# Altium schematic sheet FIT_FPGA_B-F.SchDoc: FIT_PM12 board
size 420 x 297 mm; CheckedBy: G.Kasprowicz; Author: INR Moscow; CompanyName: WUT ISE; DrawnBy: M.Podgórski; Organization: WUT ISE; Address1: PW ISE; Address2: Nowowiejska 15/19 00-665 Warsaw; Address3: gkasprow@gmail.com; Revision: 2; SheetNumber: -; SheetTotal: -; ModifiedBy: -; CheckedDate: -; Title2: Title 2; DivGrp: WUT ISE; Designer: INR RAS; ModifiedDate: -; ProjectName: Sensor Box
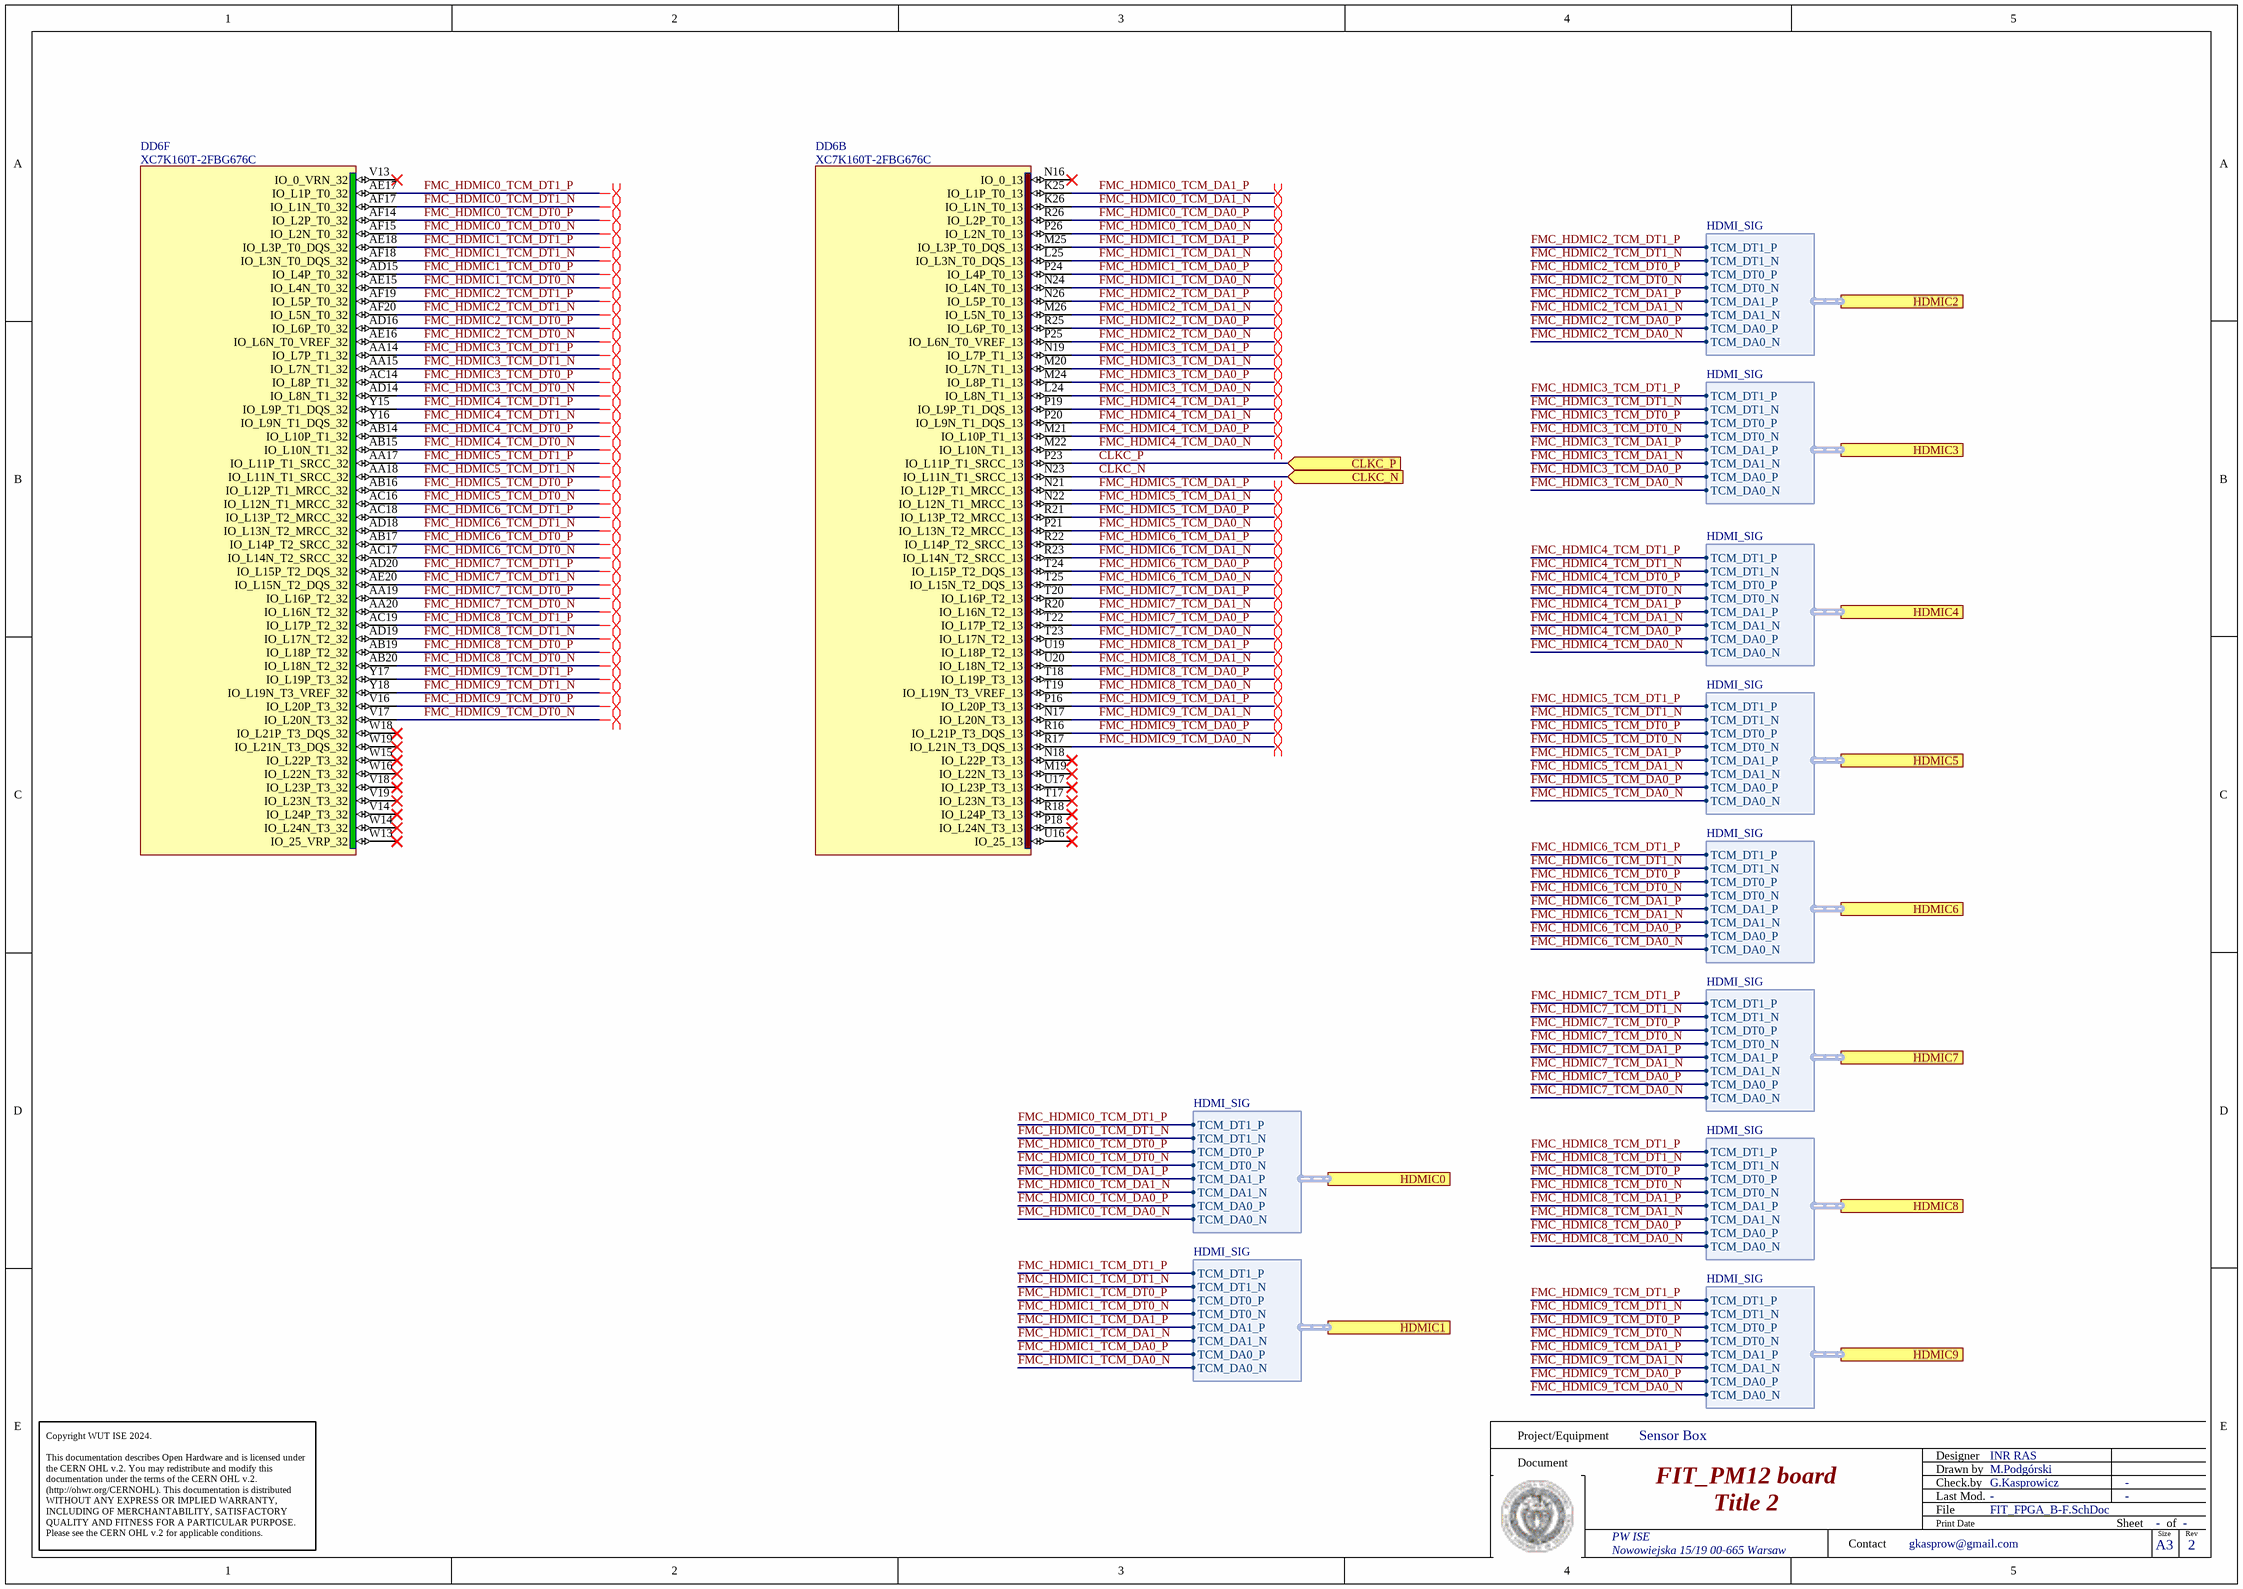
[diagram p0: FIT_FPGA_B-F.SchDoc]

## Parts
DD6  XC7K160T-2FBG676C  [BGA676C100P26X26_2700X2700X254]  (parts B,F of 15)

## Ports
CLKC_N (in), CLKC_P (in), HDMIC0 (harness HDMI_SIG), HDMIC1 (harness HDMI_SIG), HDMIC2 (harness HDMI_SIG), HDMIC3 (harness HDMI_SIG), HDMIC4 (harness HDMI_SIG), HDMIC5 (harness HDMI_SIG), HDMIC6 (harness HDMI_SIG), HDMIC7 (harness HDMI_SIG), HDMIC8 (harness HDMI_SIG), HDMIC9 (harness HDMI_SIG)

## Harnesses
HDMI_SIG: TCM_DT1_P, TCM_DT1_N, TCM_DT0_P, TCM_DT0_N, TCM_DA1_P, TCM_DA1_N, TCM_DA0_P, TCM_DA0_N

## Nets
CLKC_N: DD6.N23(IO_L11N_T1_SRCC_13) ; port CLKC_N
CLKC_P: DD6.P23(IO_L11P_T1_SRCC_13) ; port CLKC_P
FMC_HDMIC0_TCM_DA0_N: DD6.P26(IO_L2N_T0_13) ; port HDMIC0.TCM_DA0_N
FMC_HDMIC0_TCM_DA0_P: DD6.R26(IO_L2P_T0_13) ; port HDMIC0.TCM_DA0_P
FMC_HDMIC0_TCM_DA1_N: DD6.K26(IO_L1N_T0_13) ; port HDMIC0.TCM_DA1_N
FMC_HDMIC0_TCM_DA1_P: DD6.K25(IO_L1P_T0_13) ; port HDMIC0.TCM_DA1_P
FMC_HDMIC0_TCM_DT0_N: DD6.AF15(IO_L2N_T0_32) ; port HDMIC0.TCM_DT0_N
FMC_HDMIC0_TCM_DT0_P: DD6.AF14(IO_L2P_T0_32) ; port HDMIC0.TCM_DT0_P
FMC_HDMIC0_TCM_DT1_N: DD6.AF17(IO_L1N_T0_32) ; port HDMIC0.TCM_DT1_N
FMC_HDMIC0_TCM_DT1_P: DD6.AE17(IO_L1P_T0_32) ; port HDMIC0.TCM_DT1_P
FMC_HDMIC1_TCM_DA0_N: DD6.N24(IO_L4N_T0_13) ; port HDMIC1.TCM_DA0_N
FMC_HDMIC1_TCM_DA0_P: DD6.P24(IO_L4P_T0_13) ; port HDMIC1.TCM_DA0_P
FMC_HDMIC1_TCM_DA1_N: DD6.L25(IO_L3N_T0_DQS_13) ; port HDMIC1.TCM_DA1_N
FMC_HDMIC1_TCM_DA1_P: DD6.M25(IO_L3P_T0_DQS_13) ; port HDMIC1.TCM_DA1_P
FMC_HDMIC1_TCM_DT0_N: DD6.AE15(IO_L4N_T0_32) ; port HDMIC1.TCM_DT0_N
FMC_HDMIC1_TCM_DT0_P: DD6.AD15(IO_L4P_T0_32) ; port HDMIC1.TCM_DT0_P
FMC_HDMIC1_TCM_DT1_N: DD6.AF18(IO_L3N_T0_DQS_32) ; port HDMIC1.TCM_DT1_N
FMC_HDMIC1_TCM_DT1_P: DD6.AE18(IO_L3P_T0_DQS_32) ; port HDMIC1.TCM_DT1_P
FMC_HDMIC2_TCM_DA0_N: DD6.P25(IO_L6N_T0_VREF_13) ; port HDMIC2.TCM_DA0_N
FMC_HDMIC2_TCM_DA0_P: DD6.R25(IO_L6P_T0_13) ; port HDMIC2.TCM_DA0_P
FMC_HDMIC2_TCM_DA1_N: DD6.M26(IO_L5N_T0_13) ; port HDMIC2.TCM_DA1_N
FMC_HDMIC2_TCM_DA1_P: DD6.N26(IO_L5P_T0_13) ; port HDMIC2.TCM_DA1_P
FMC_HDMIC2_TCM_DT0_N: DD6.AE16(IO_L6N_T0_VREF_32) ; port HDMIC2.TCM_DT0_N
FMC_HDMIC2_TCM_DT0_P: DD6.AD16(IO_L6P_T0_32) ; port HDMIC2.TCM_DT0_P
FMC_HDMIC2_TCM_DT1_N: DD6.AF20(IO_L5N_T0_32) ; port HDMIC2.TCM_DT1_N
FMC_HDMIC2_TCM_DT1_P: DD6.AF19(IO_L5P_T0_32) ; port HDMIC2.TCM_DT1_P
FMC_HDMIC3_TCM_DA0_N: DD6.L24(IO_L8N_T1_13) ; port HDMIC3.TCM_DA0_N
FMC_HDMIC3_TCM_DA0_P: DD6.M24(IO_L8P_T1_13) ; port HDMIC3.TCM_DA0_P
FMC_HDMIC3_TCM_DA1_N: DD6.M20(IO_L7N_T1_13) ; port HDMIC3.TCM_DA1_N
FMC_HDMIC3_TCM_DA1_P: DD6.N19(IO_L7P_T1_13) ; port HDMIC3.TCM_DA1_P
FMC_HDMIC3_TCM_DT0_N: DD6.AD14(IO_L8N_T1_32) ; port HDMIC3.TCM_DT0_N
FMC_HDMIC3_TCM_DT0_P: DD6.AC14(IO_L8P_T1_32) ; port HDMIC3.TCM_DT0_P
FMC_HDMIC3_TCM_DT1_N: DD6.AA15(IO_L7N_T1_32) ; port HDMIC3.TCM_DT1_N
FMC_HDMIC3_TCM_DT1_P: DD6.AA14(IO_L7P_T1_32) ; port HDMIC3.TCM_DT1_P
FMC_HDMIC4_TCM_DA0_N: DD6.M22(IO_L10N_T1_13) ; port HDMIC4.TCM_DA0_N
FMC_HDMIC4_TCM_DA0_P: DD6.M21(IO_L10P_T1_13) ; port HDMIC4.TCM_DA0_P
FMC_HDMIC4_TCM_DA1_N: DD6.P20(IO_L9N_T1_DQS_13) ; port HDMIC4.TCM_DA1_N
FMC_HDMIC4_TCM_DA1_P: DD6.P19(IO_L9P_T1_DQS_13) ; port HDMIC4.TCM_DA1_P
FMC_HDMIC4_TCM_DT0_N: DD6.AB15(IO_L10N_T1_32) ; port HDMIC4.TCM_DT0_N
FMC_HDMIC4_TCM_DT0_P: DD6.AB14(IO_L10P_T1_32) ; port HDMIC4.TCM_DT0_P
FMC_HDMIC4_TCM_DT1_N: DD6.Y16(IO_L9N_T1_DQS_32) ; port HDMIC4.TCM_DT1_N
FMC_HDMIC4_TCM_DT1_P: DD6.Y15(IO_L9P_T1_DQS_32) ; port HDMIC4.TCM_DT1_P
FMC_HDMIC5_TCM_DA0_N: DD6.P21(IO_L13N_T2_MRCC_13) ; port HDMIC5.TCM_DA0_N
FMC_HDMIC5_TCM_DA0_P: DD6.R21(IO_L13P_T2_MRCC_13) ; port HDMIC5.TCM_DA0_P
FMC_HDMIC5_TCM_DA1_N: DD6.N22(IO_L12N_T1_MRCC_13) ; port HDMIC5.TCM_DA1_N
FMC_HDMIC5_TCM_DA1_P: DD6.N21(IO_L12P_T1_MRCC_13) ; port HDMIC5.TCM_DA1_P
FMC_HDMIC5_TCM_DT0_N: DD6.AC16(IO_L12N_T1_MRCC_32) ; port HDMIC5.TCM_DT0_N
FMC_HDMIC5_TCM_DT0_P: DD6.AB16(IO_L12P_T1_MRCC_32) ; port HDMIC5.TCM_DT0_P
FMC_HDMIC5_TCM_DT1_N: DD6.AA18(IO_L11N_T1_SRCC_32) ; port HDMIC5.TCM_DT1_N
FMC_HDMIC5_TCM_DT1_P: DD6.AA17(IO_L11P_T1_SRCC_32) ; port HDMIC5.TCM_DT1_P
FMC_HDMIC6_TCM_DA0_N: DD6.T25(IO_L15N_T2_DQS_13) ; port HDMIC6.TCM_DA0_N
FMC_HDMIC6_TCM_DA0_P: DD6.T24(IO_L15P_T2_DQS_13) ; port HDMIC6.TCM_DA0_P
FMC_HDMIC6_TCM_DA1_N: DD6.R23(IO_L14N_T2_SRCC_13) ; port HDMIC6.TCM_DA1_N
FMC_HDMIC6_TCM_DA1_P: DD6.R22(IO_L14P_T2_SRCC_13) ; port HDMIC6.TCM_DA1_P
FMC_HDMIC6_TCM_DT0_N: DD6.AC17(IO_L14N_T2_SRCC_32) ; port HDMIC6.TCM_DT0_N
FMC_HDMIC6_TCM_DT0_P: DD6.AB17(IO_L14P_T2_SRCC_32) ; port HDMIC6.TCM_DT0_P
FMC_HDMIC6_TCM_DT1_N: DD6.AD18(IO_L13N_T2_MRCC_32) ; port HDMIC6.TCM_DT1_N
FMC_HDMIC6_TCM_DT1_P: DD6.AC18(IO_L13P_T2_MRCC_32) ; port HDMIC6.TCM_DT1_P
FMC_HDMIC7_TCM_DA0_N: DD6.T23(IO_L17N_T2_13) ; port HDMIC7.TCM_DA0_N
FMC_HDMIC7_TCM_DA0_P: DD6.T22(IO_L17P_T2_13) ; port HDMIC7.TCM_DA0_P
FMC_HDMIC7_TCM_DA1_N: DD6.R20(IO_L16N_T2_13) ; port HDMIC7.TCM_DA1_N
FMC_HDMIC7_TCM_DA1_P: DD6.T20(IO_L16P_T2_13) ; port HDMIC7.TCM_DA1_P
FMC_HDMIC7_TCM_DT0_N: DD6.AA20(IO_L16N_T2_32) ; port HDMIC7.TCM_DT0_N
FMC_HDMIC7_TCM_DT0_P: DD6.AA19(IO_L16P_T2_32) ; port HDMIC7.TCM_DT0_P
FMC_HDMIC7_TCM_DT1_N: DD6.AE20(IO_L15N_T2_DQS_32) ; port HDMIC7.TCM_DT1_N
FMC_HDMIC7_TCM_DT1_P: DD6.AD20(IO_L15P_T2_DQS_32) ; port HDMIC7.TCM_DT1_P
FMC_HDMIC8_TCM_DA0_N: DD6.T19(IO_L19N_T3_VREF_13) ; port HDMIC8.TCM_DA0_N
FMC_HDMIC8_TCM_DA0_P: DD6.T18(IO_L19P_T3_13) ; port HDMIC8.TCM_DA0_P
FMC_HDMIC8_TCM_DA1_N: DD6.U20(IO_L18N_T2_13) ; port HDMIC8.TCM_DA1_N
FMC_HDMIC8_TCM_DA1_P: DD6.U19(IO_L18P_T2_13) ; port HDMIC8.TCM_DA1_P
FMC_HDMIC8_TCM_DT0_N: DD6.AB20(IO_L18N_T2_32) ; port HDMIC8.TCM_DT0_N
FMC_HDMIC8_TCM_DT0_P: DD6.AB19(IO_L18P_T2_32) ; port HDMIC8.TCM_DT0_P
FMC_HDMIC8_TCM_DT1_N: DD6.AD19(IO_L17N_T2_32) ; port HDMIC8.TCM_DT1_N
FMC_HDMIC8_TCM_DT1_P: DD6.AC19(IO_L17P_T2_32) ; port HDMIC8.TCM_DT1_P
FMC_HDMIC9_TCM_DA0_N: DD6.R17(IO_L21N_T3_DQS_13) ; port HDMIC9.TCM_DA0_N
FMC_HDMIC9_TCM_DA0_P: DD6.R16(IO_L21P_T3_DQS_13) ; port HDMIC9.TCM_DA0_P
FMC_HDMIC9_TCM_DA1_N: DD6.N17(IO_L20N_T3_13) ; port HDMIC9.TCM_DA1_N
FMC_HDMIC9_TCM_DA1_P: DD6.P16(IO_L20P_T3_13) ; port HDMIC9.TCM_DA1_P
FMC_HDMIC9_TCM_DT0_N: DD6.V17(IO_L20N_T3_32) ; port HDMIC9.TCM_DT0_N
FMC_HDMIC9_TCM_DT0_P: DD6.V16(IO_L20P_T3_32) ; port HDMIC9.TCM_DT0_P
FMC_HDMIC9_TCM_DT1_N: DD6.Y18(IO_L19N_T3_VREF_32) ; port HDMIC9.TCM_DT1_N
FMC_HDMIC9_TCM_DT1_P: DD6.Y17(IO_L19P_T3_32) ; port HDMIC9.TCM_DT1_P

Not connected (* = marked no-connect by the designer): DD6 M19(IO_L22N_T3_13)* N16(IO_0_13)* N18(IO_L22P_T3_13)* P18(IO_L24N_T3_13)* R18(IO_L24P_T3_13)* T17(IO_L23N_T3_13)* U16(IO_25_13)* U17(IO_L23P_T3_13)* V13(IO_0_VRN_32)* V14(IO_L24P_T3_32)* V18(IO_L23P_T3_32)* V19(IO_L23N_T3_32)* W13(IO_25_VRP_32)* W14(IO_L24N_T3_32)* W15(IO_L22P_T3_32)* W16(IO_L22N_T3_32)* W18(IO_L21P_T3_DQS_32)* W19(IO_L21N_T3_DQS_32)*

## Layout directives
differential pair: FMC_HDMIC0_TCM_DA0_N, FMC_HDMIC0_TCM_DA0_P, FMC_HDMIC0_TCM_DA1_N, FMC_HDMIC0_TCM_DA1_P, FMC_HDMIC0_TCM_DT0_N, FMC_HDMIC0_TCM_DT0_P, FMC_HDMIC0_TCM_DT1_N, FMC_HDMIC0_TCM_DT1_P, FMC_HDMIC1_TCM_DA0_N, FMC_HDMIC1_TCM_DA0_P, FMC_HDMIC1_TCM_DA1_N, FMC_HDMIC1_TCM_DA1_P, FMC_HDMIC1_TCM_DT0_N, FMC_HDMIC1_TCM_DT0_P, FMC_HDMIC1_TCM_DT1_N, FMC_HDMIC1_TCM_DT1_P, FMC_HDMIC2_TCM_DA0_N, FMC_HDMIC2_TCM_DA0_P, FMC_HDMIC2_TCM_DA1_N, FMC_HDMIC2_TCM_DA1_P, FMC_HDMIC2_TCM_DT0_N, FMC_HDMIC2_TCM_DT0_P, FMC_HDMIC2_TCM_DT1_N, FMC_HDMIC2_TCM_DT1_P, FMC_HDMIC3_TCM_DA0_N, FMC_HDMIC3_TCM_DA0_P, FMC_HDMIC3_TCM_DA1_N, FMC_HDMIC3_TCM_DA1_P, FMC_HDMIC3_TCM_DT0_N, FMC_HDMIC3_TCM_DT0_P, FMC_HDMIC3_TCM_DT1_N, FMC_HDMIC3_TCM_DT1_P, FMC_HDMIC4_TCM_DA0_N, FMC_HDMIC4_TCM_DA0_P, FMC_HDMIC4_TCM_DA1_N, FMC_HDMIC4_TCM_DA1_P, FMC_HDMIC4_TCM_DT0_N, FMC_HDMIC4_TCM_DT0_P, FMC_HDMIC4_TCM_DT1_N, FMC_HDMIC4_TCM_DT1_P, FMC_HDMIC5_TCM_DA0_N, FMC_HDMIC5_TCM_DA0_P, FMC_HDMIC5_TCM_DA1_N, FMC_HDMIC5_TCM_DA1_P, FMC_HDMIC5_TCM_DT0_N, FMC_HDMIC5_TCM_DT0_P, FMC_HDMIC5_TCM_DT1_N, FMC_HDMIC5_TCM_DT1_P, FMC_HDMIC6_TCM_DA0_N, FMC_HDMIC6_TCM_DA0_P, FMC_HDMIC6_TCM_DA1_N, FMC_HDMIC6_TCM_DA1_P, FMC_HDMIC6_TCM_DT0_N, FMC_HDMIC6_TCM_DT0_P, FMC_HDMIC6_TCM_DT1_N, FMC_HDMIC6_TCM_DT1_P, FMC_HDMIC7_TCM_DA0_N, FMC_HDMIC7_TCM_DA0_P, FMC_HDMIC7_TCM_DA1_N, FMC_HDMIC7_TCM_DA1_P, FMC_HDMIC7_TCM_DT0_N, FMC_HDMIC7_TCM_DT0_P, FMC_HDMIC7_TCM_DT1_N, FMC_HDMIC7_TCM_DT1_P, FMC_HDMIC8_TCM_DA0_N, FMC_HDMIC8_TCM_DA0_P, FMC_HDMIC8_TCM_DA1_N, FMC_HDMIC8_TCM_DA1_P, FMC_HDMIC8_TCM_DT0_N, FMC_HDMIC8_TCM_DT0_P, FMC_HDMIC8_TCM_DT1_N, FMC_HDMIC8_TCM_DT1_P, FMC_HDMIC9_TCM_DA0_N, FMC_HDMIC9_TCM_DA0_P, FMC_HDMIC9_TCM_DA1_N, FMC_HDMIC9_TCM_DA1_P, FMC_HDMIC9_TCM_DT0_N, FMC_HDMIC9_TCM_DT0_P, FMC_HDMIC9_TCM_DT1_N, FMC_HDMIC9_TCM_DT1_P

## Notes on the sheet
- Project/Equipment
- Document
- Designer
- Drawn by
- Check.by
- Copyright WUT ISE 2024.
  This documentation describes Open Hardware and is licensed under the CERN OHL v.2. You may redistribute and modify this documentation under the terms of the CERN OHL v.2. (http://ohwr.org/CERNOHL). This documentation is distributed WITHOUT ANY EXPRESS OR IMPLIED WARRANTY, INCLUDING OF MERCHANTABILITY, SATISFACTORY QUALITY AND FITNESS FOR A PARTICULAR PURPOSE. Please see the CERN OHL v.2 for applicable conditions.
- Contact
- File
- Last Mod.
- Print Date
- Sheet
- Size
- A3
- of
- Rev

## Library data of the parts
DD6 = XC7K160T-2FBG676C: KINTEX-7, FPGA, 676-Ball BGA, Pb-Free; Part Description: KINTEX-7 FPGA, 162240 Logic Cells, 400 User I/O, 8 GTXs, 676-Ball BGA, Speed Grade 2, Commercial Grade, Pb-Free; Manufacturer: XILINX; PressFit: No; Bonding: No; Part Number: XC7K160T-2FBG676C; Component Kind: Standard; Component Type: Standard; Device: XC7K160T-2FBG676C; PackageDescription: BGA, 1.00mm Pitch, Square; 676 Pin, 26 Columns X 26 Rows, Body 27.0mm X 27.0mm X 2.54mm H, IPC Medium Density; Manufacturer Part Number: XC7K160T-2FBG676C; Pin Count: 676; Case: BGA676; Mounted: Yes; Socket: No; SMD: Yes; Sense: No; ComponentHeight: 2.54mm; HelpURL: \\cern.ch\dfs\Applications\Altium\Datasheets\XC7K160T-xFBG676C.pdf; ComponentLink1URL: \\cern.ch\dfs\Applications\Altium\Datasheets\XC7K160T-xFBG676C_Package-Pinout.pdf; ComponentLink1Description: Package/Pinout; Author: CERN DEM BC; CreateDate: 06.02.2020; LatestRevisionDate: 06.02.2020